# EAGLE board PFCEDU_V2 (EAGLE 9.1.1), part 1 of 3
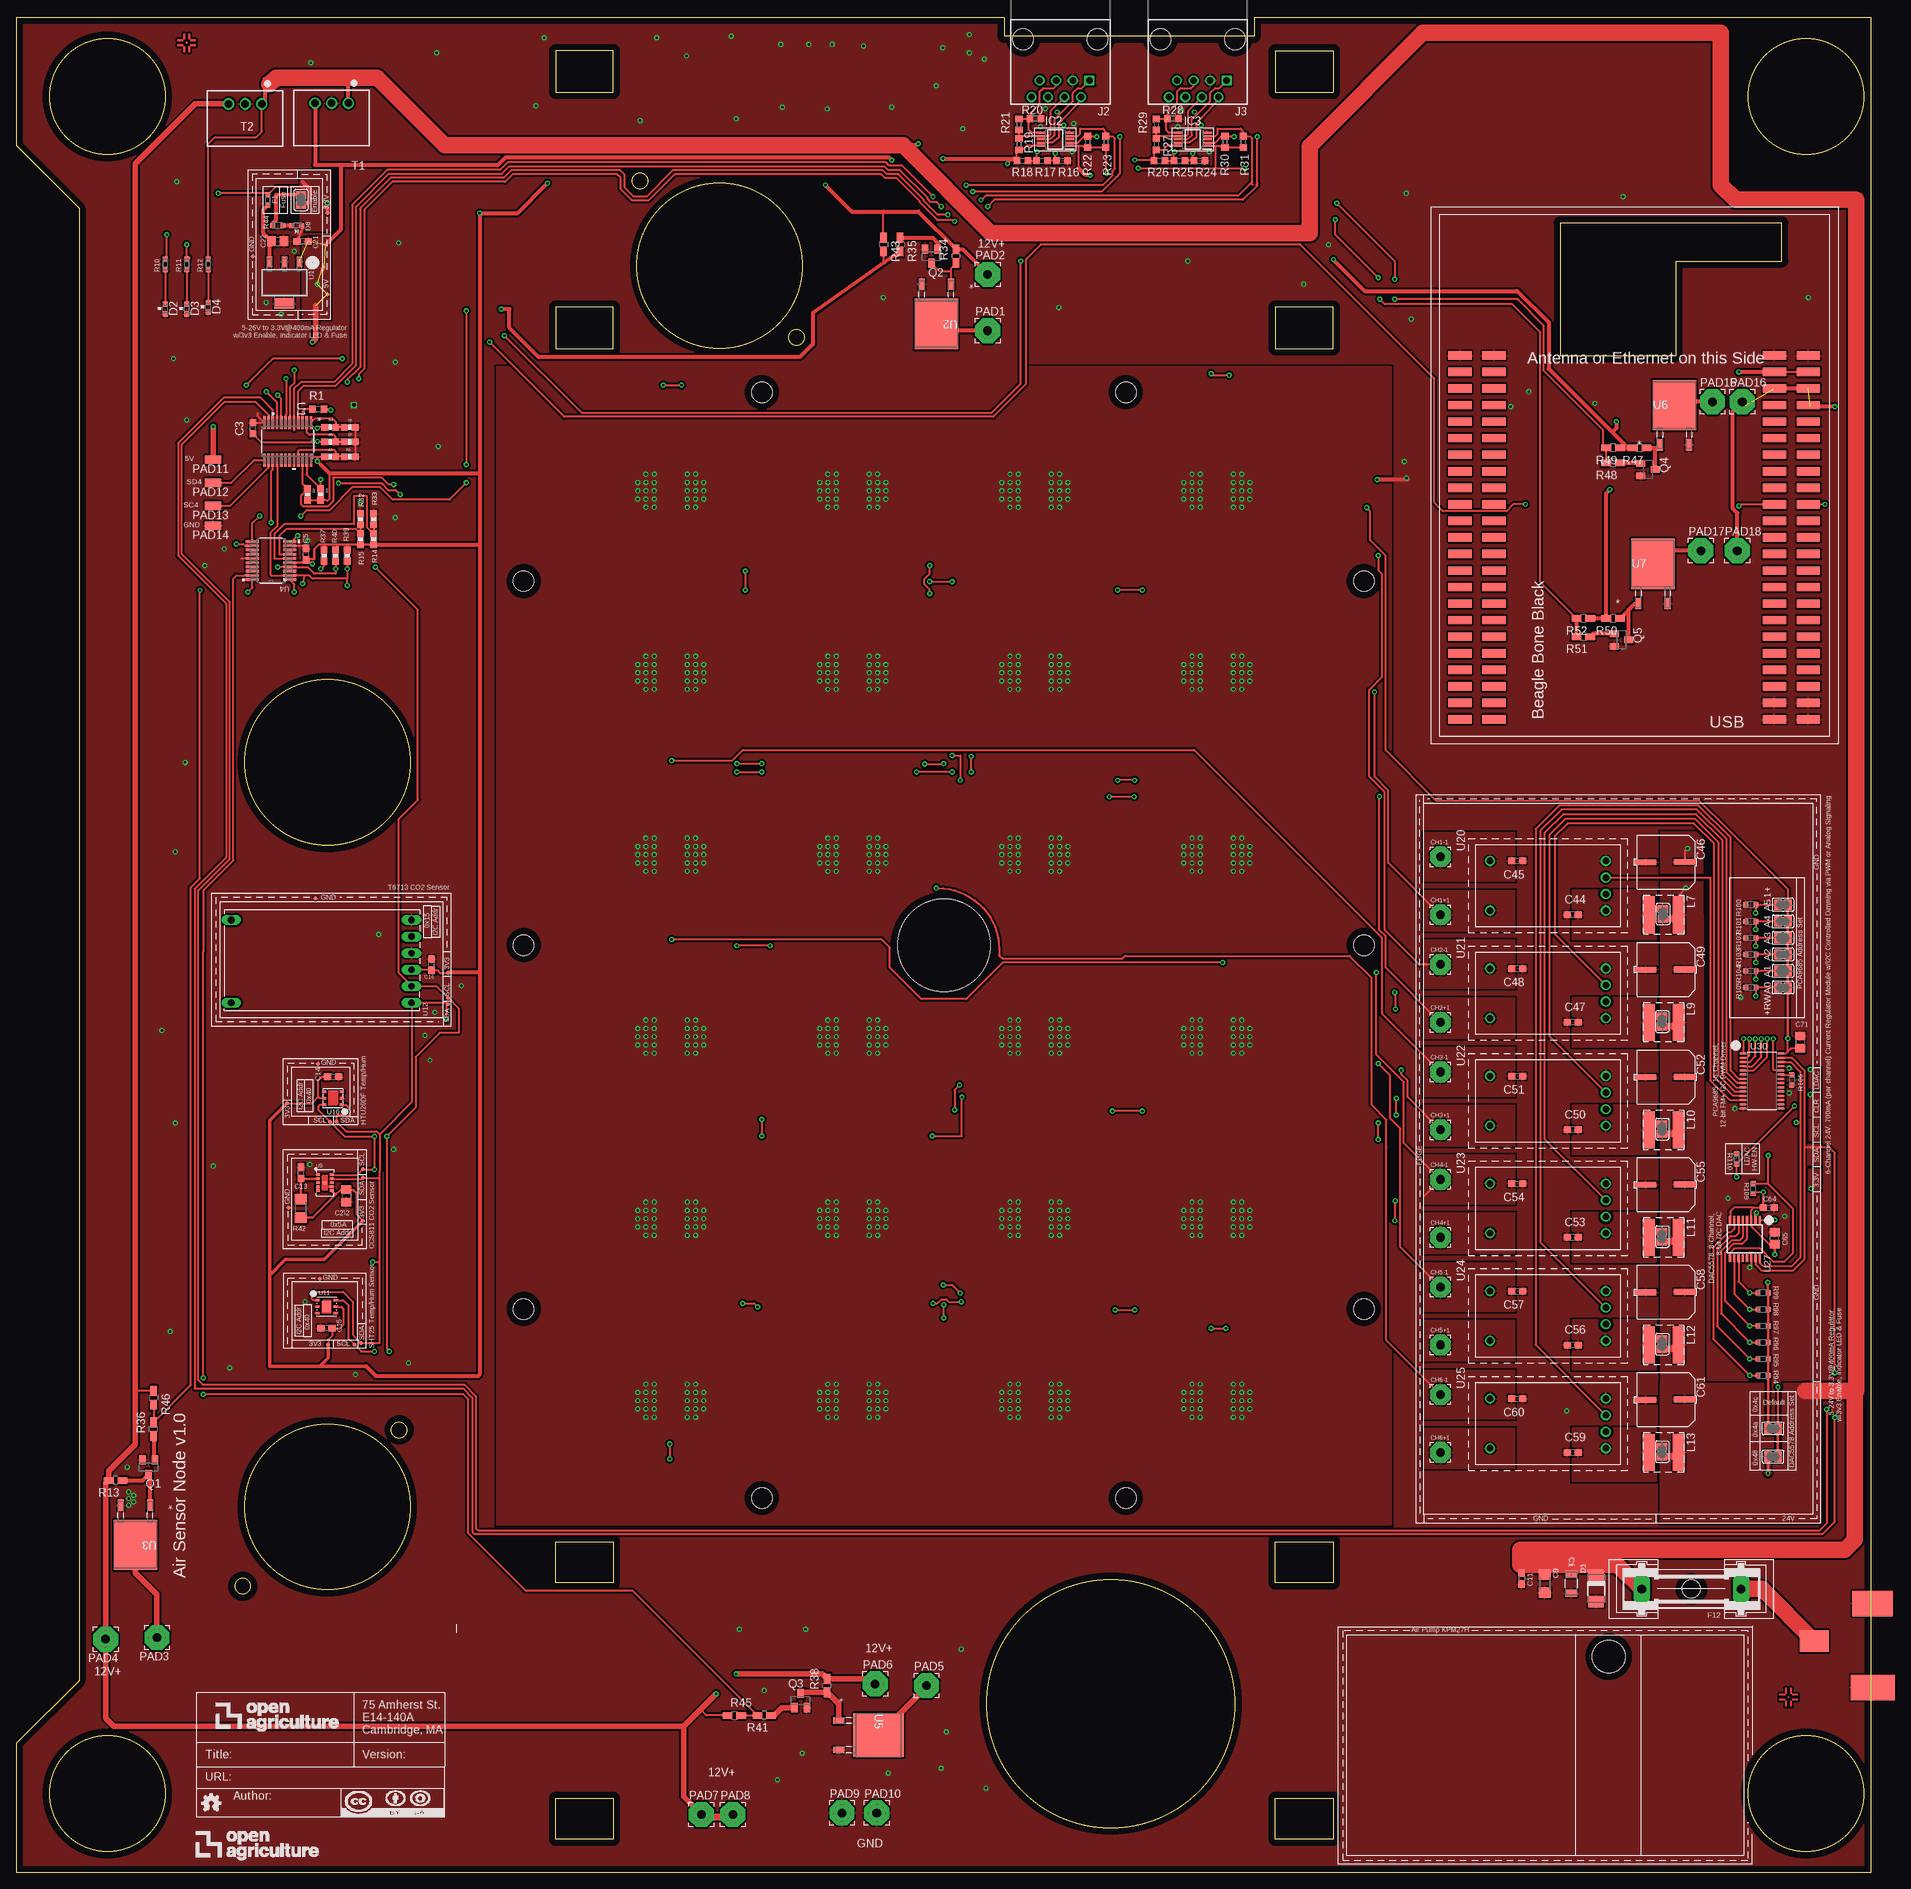
[diagram p3: board, top side]
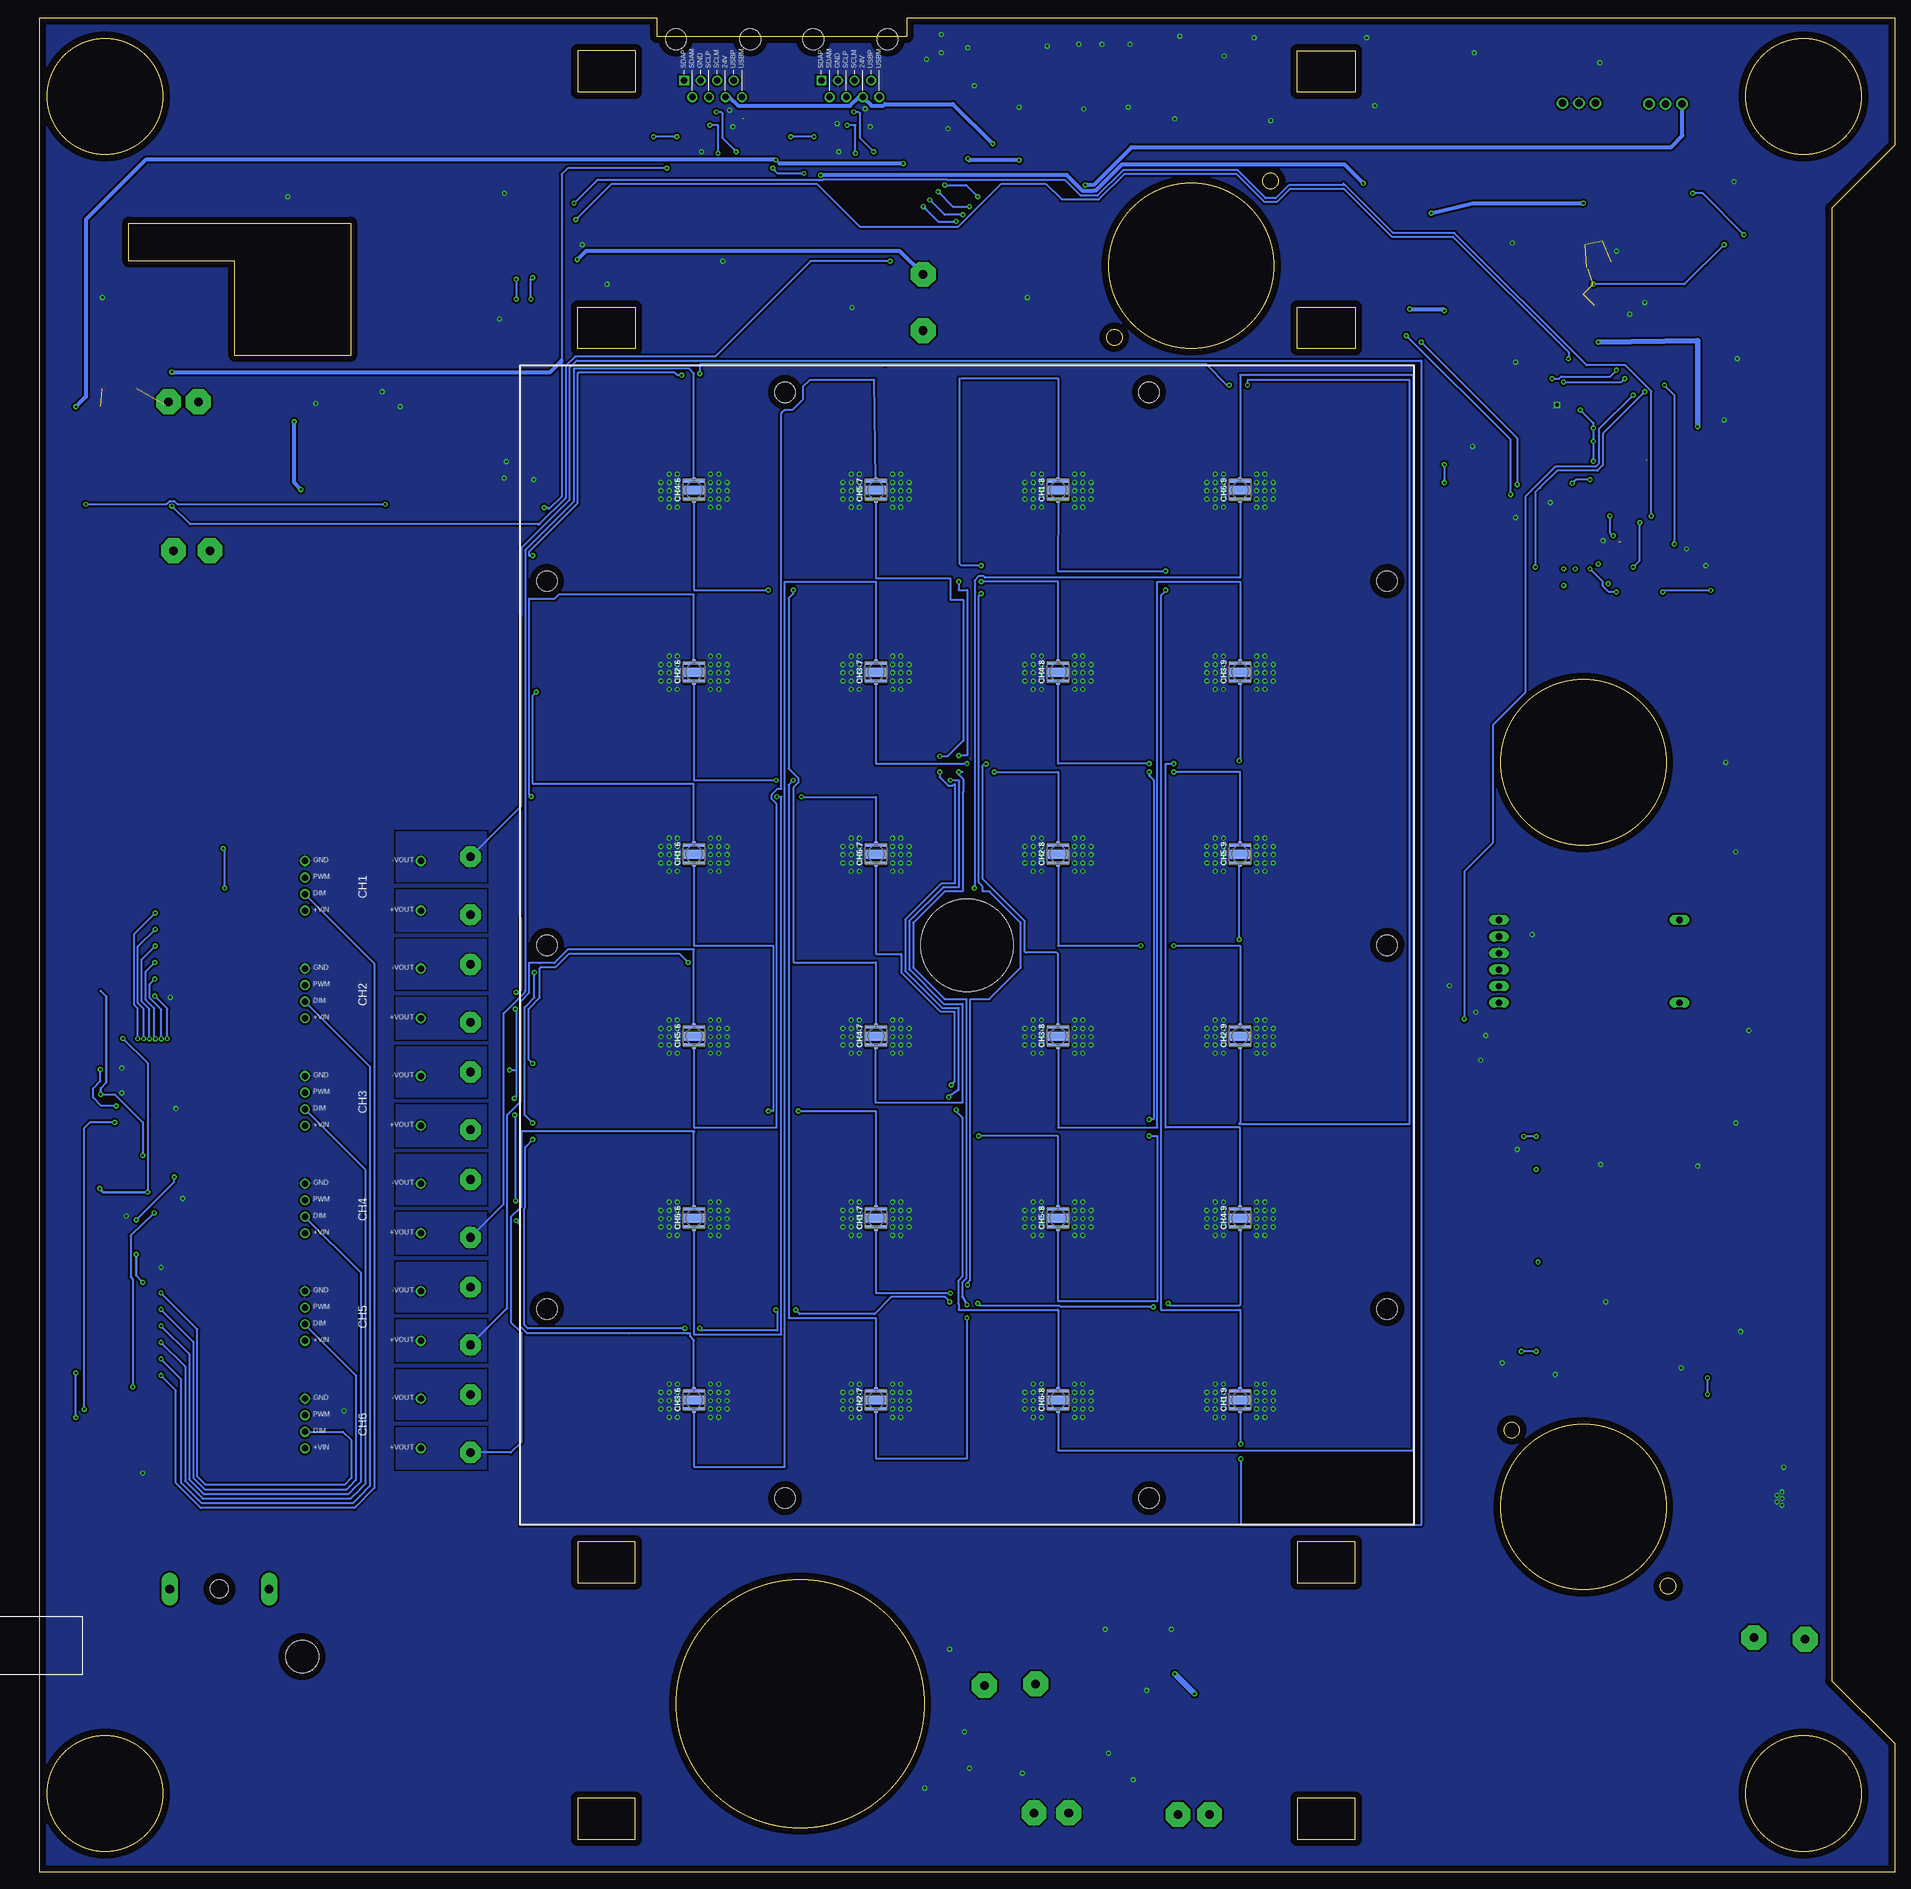
[diagram p4: board, bottom side, seen from below]

Size 284.73 x 284.79 mm. Coordinates in mm from the lower left corner, seen from the top.
Outline: 224.54,284.73 284.73,284.73 284.73,0 0,0 0,19.81 9.65,29.46 9.65,255.52 0,265.18 0,284.73 151.62,284.73 151.62,281.94 189.99,281.94 189.99,284.79 224.73,284.73
Outline: 91.66,279.71 82.77,279.71 82.77,273.36 91.66,273.36 91.66,279.71
Outline: 91.66,240.34 82.77,240.34 82.77,233.99 91.66,233.99 91.66,240.34
Outline: 202.15,240.34 193.26,240.34 193.26,233.99 202.15,233.99 202.15,240.34
Outline: 193.26,273.36 202.15,273.36 202.15,279.71 193.26,279.71 193.26,273.36
Outline: 202.15,11.43 202.15,5.08 193.26,5.08 193.26,11.43 202.15,11.43
Outline: 202.15,50.8 202.15,44.45 193.26,44.45 193.26,50.8 202.15,50.8
Outline: 91.66,11.43 91.66,5.08 82.77,5.08 82.77,11.43 91.66,11.43
Outline: 91.66,50.8 91.66,44.45 82.77,44.45 82.77,50.8 91.66,50.8
Outline: 236.98,253.24 236.98,232.92 254.76,232.92 254.76,247.4 271.02,247.4 271.02,253.24 236.98,253.24
Outline: circle at 274.7,12.1 radius 8.89
Outline: circle at 13.97,12.1 radius 8.89
Outline: circle at 119.75,235.7 radius 1.2
Outline: circle at 95.76,259.68 radius 1.2
Outline: circle at 58.75,67.93 radius 1.2
Outline: circle at 34.76,43.94 radius 1.2
Outline: circle at 47.75,170.43 radius 12.7
Outline: circle at 47.75,56.13 radius 12.7
Outline: circle at 274.7,272.69 radius 8.89
Outline: circle at 167.99,25.91 radius 19.05
Outline: circle at 107.95,246.69 radius 12.7
Outline: circle at 13.97,272.69 radius 8.89
Copper layers (1*16): Top 0.035mm / dielectric 1.5mm / Bottom 0.035mm
Design rules "default *": minimum track width 6mil, minimum drill 0.35mm, track to track 4mil, track to pad 4mil, pad to pad 6mil, via to via 6mil, smd to smd 6mil, copper to edge 40mil, drill to drill 6mil, minimum pad ring 10mil, minimum via ring 8mil, stop-mask expansion 4mil, vias tented up to drill 25mil, thermal gap 10mil
Net classes: 0 default: width 0.305 mm, drill 0.254 mm, clearance 0.254 mm
Holes 3.17 mm at 114.43,57.48 170.31,57.48 206.86,86.51 206.86,142.39 206.86,198.27 170.31,227.28 114.43,227.28 77.88,198.27 77.88,142.39 77.88,86.51
Holes 14.22 mm at 142.37,142.37
Holes 5.08 mm at 244.42,33.15
Milling: 2 lines

## Footprints (pad centres in the part's own frame; a part is rotated, then mirrored left to right if it is on the bottom)
CAP_C1206 = smd 1.118 x 1.803: 1 -1.499,0; 2 1.499,0
C0805 = smd 1.3 x 1.5: 1 -0.95,0; 2 0.95,0
C0603@1 = smd 1.1 x 1: 1 -0.85,0; 2 0.85,0
C1206 = smd 1.6 x 1.8: 1 -1.4,0; 2 1.4,0
C0603 = smd 1.1 x 1: 1 -0.85,0; 2 0.85,0
EEE-1HA101UP = smd 0.889 x 3.404: + 0,-3.251 | smd 0.889 x 3.251: - -0.051,2.794
3,17/1,3 = drill 1.321 pad 3.175 octagon: 1 0,0
CREE-XLAMP-XP-E = smd 0.5 x 3.3: A 1.4,0; C -1.4,0 | smd 0.45 x 0.5: A@1 1.725,0; C@1 -1.725,0 | smd 1.3 x 3.3: THERM 0,0
DO-214AC = smd 1.8 x 2.4: A 2.025,0; C -2.025,0
CHIPLED_0603 = smd 0.8 x 0.8: A 0,-0.75; C 0,0.75
0603 = smd 0.756 x 0.8: 1 -0.778,0; 2 0.778,0
GSH15 = drill 1.321 pad 2.54 long: 1 -7.62,0; 2 7.62,0 | hole 2.794: 0,0
SOP50P490X110-10N = smd 1.4 x 0.3: 1 -2.2,1; 2 -2.2,0.5; 3 -2.2,0; 4 -2.2,-0.5; 5 -2.2,-1; 6 2.2,-1; 7 2.2,-0.5; 8 2.2,0; 9 2.2,0.5; 10 2.2,1
OPENAG-V1-RJ45 = drill 1: 24V(6) 1.905,8.89; DSCLM(5) 0.635,6.35; DSCLP(4) -0.635,8.89; DSDAM(2) -3.175,8.89; GND(3) -1.905,6.35; USBM(8) 4.445,8.89; USBP(7) 3.175,6.35 | drill 1 square: DSDAP(1) -4.445,6.35 | hole 3.2: -5.715,0; 5.715,0
74404064121 = smd 1.8 x 5.7: 1 -2.3,0; 2 2.3,0
3,81/1,3 = drill 1.321 pad 3.81 octagon: 1 0,0
SMD1,27-2,54 = smd 1.27 x 2.54: 1 0,0
SOT23-BEC = smd 1 x 1.4: B -0.95,-1.1; C 0,1.1; E 0.95,-1.1
R0603 = smd 1 x 1.1: 1 -0.85,0; 2 0.85,0
0603-RES = smd 1.1 x 1: 1 -0.85,0; 2 0.85,0
RC0603N = smd 0.756 x 0.8: 1 -0.778,0; 2 0.778,0
R0805W = smd 1.5 x 1: 1 -1.052,0; 2 1.052,0
R1206 = smd 1.6 x 1.803: 1 -1.422,0; 2 1.422,0
SOLDERJUMPER_REFLOW_NOPASTE = smd 1.168 x 1.6: 1 -0.762,0; 2 0.762,0
R-78E5.0-1.0 = drill 1.15 pad 1.75: 1 3.21,2; 2 5.75,2; 3 8.29,2
TP06R = smd 0.6 x 0.6: TP 0,0
PW24-M = smd 1.981 x 0.406: 1 -2.87,3.575; 2 -2.87,2.925; 3 -2.87,2.275; 4 -2.87,1.625; 5 -2.87,0.975; 6 -2.87,0.325; 7 -2.87,-0.325; 8 -2.87,-0.975; 9 -2.87,-1.625; 10 -2.87,-2.275; 11 -2.87,-2.925; 12 -2.87,-3.575; 13 2.87,-3.575; 14 2.87,-2.925; 15 2.87,-2.275; 16 2.87,-1.625; 17 2.87,-0.975; 18 2.87,-0.325; 19 2.87,0.325; 20 2.87,0.975; 21 2.87,1.625; 22 2.87,2.275; 23 2.87,2.925; 24 2.87,3.575
DPAK = smd 0.94 x 1.702: 1 -2.25,-6.109; 2 2.25,-6.109 | smd 6.655 x 7.722: 3 0,0
PW20-M = smd 1.981 x 0.406: 1 -2.87,2.925; 2 -2.87,2.275; 3 -2.87,1.625; 4 -2.87,0.975; 5 -2.87,0.325; 6 -2.87,-0.325; 7 -2.87,-0.975; 8 -2.87,-1.625; 9 -2.87,-2.275; 10 -2.87,-2.925; 11 2.87,-2.925; 12 2.87,-2.275; 13 2.87,-1.625; 14 2.87,-0.975; 15 2.87,-0.325; 16 2.87,0.325; 17 2.87,0.975; 18 2.87,1.625; 19 2.87,2.275; 20 2.87,2.925
CCS811 = smd 0.6 x 0.4: 1 -1.05,1.2; 2 -1.05,0.6; 3 -1.05,0; 4 -1.05,-0.6; 5 -1.05,-1.2; 6 1.05,-1.2; 7 1.05,-0.6; 8 1.05,0; 9 1.05,0.6; 10 1.05,1.2; EP 0,0
HTU20D(F) = smd 0.4 x 0.6: 1 -1,-1.35; 2 0,-1.35; 3 1,-1.35; 4 1,1.35; 5 0,1.35; 6 -1,1.35
SHT2X = smd 0.3 x 0.4: 1 -1,-1.4; 2 0,-1.4; 3 1,-1.4; 4 1,1.4; 5 0,1.4; 6 -1,1.4 | smd 1.651 x 1.27: 7 0,0
T6713 = drill 1.016 long: 1 1.27,-1.27; 2 1.27,-3.81; 3 1.27,-6.35; 4 1.27,-8.89; 5 1.27,-11.43; 6 1.27,-13.97; 7 28.96,-13.97; 8 28.96,-1.27
MP04A = smd 1.6 x 0.838: 1 -3.2,2.3; 2 -3.2,0; 3 -3.2,-2.3 | smd 1.6 x 3.099: 4 3.2,0
RCD-24-PINNED = drill 1: 1 0,0; 2 0,-2.54; 3 0,-5.08; 4 0,-7.62; 5 17.78,-7.62; 6 17.78,0
TSSOP16 = smd 0.35 x 1.2: 1 -2.275,-2.925; 2 -1.625,-2.925; 3 -0.975,-2.925; 4 -0.325,-2.925; 5 0.325,-2.925; 6 0.975,-2.925; 7 1.625,-2.925; 8 2.275,-2.925; 9 2.275,2.925; 10 1.625,2.925; 11 0.975,2.925; 12 0.325,2.925; 13 -0.325,2.925; 14 -0.975,2.925; 15 -1.625,2.925; 16 -2.275,2.925
TSSOP28 = smd 0.305 x 0.991: 1 -4.225,-2.918; 2 -3.575,-2.918; 3 -2.925,-2.918; 4 -2.275,-2.918; 5 -1.625,-2.918; 6 -0.975,-2.918; 7 -0.325,-2.918; 8 0.325,-2.918; 9 0.975,-2.918; 10 1.625,-2.918; 11 2.275,-2.918; 12 2.925,-2.918; 13 3.575,-2.918; 14 4.225,-2.918; 15 4.225,2.918; 16 3.575,2.918; 17 2.925,2.918; 18 2.275,2.918; 19 1.625,2.918; 20 0.975,2.918; 21 0.325,2.918; 22 -0.325,2.918; 23 -0.975,2.918; 24 -1.625,2.918; 25 -2.275,2.918; 26 -2.925,2.918; 27 -3.575,2.918; 28 -4.225,2.918
PJ-036AH = smd 4.4 x 3.3: 1 2.2,-0.65 | smd 6.75 x 3.9: 2 -6.75,6.45 | smd 6.2 x 3.9: 3 -6.75,-6.45
23PINHEADERSMD = smd 1.27 x 3.556: AIN0 7.62,0; AIN1 7.62,5.207; AIN2 10.16,0; AIN3 10.16,5.207; AIN4 15.24,0; AIN5 12.7,5.207; AIN6 12.7,0; DGND 55.88,0; DGND1 2.54,0; DGND2 0,0; DGND3 0,5.207; DGND4 2.54,5.207; DGND5 55.88,5.207; DGND6 55.88,48.26; DGND7 55.88,53.467; ECAPWMO 5.08,5.207; EHRPWM1A 40.64,5.207; EHRPWM1B 38.1,5.207; EHRPWM2A 33.02,48.26; EHRPWM2B 40.64,48.26; GND_ADC 15.24,5.207; GPIO_20 5.08,0; GPIO_26 40.64,53.467; GPIO_27 35.56,48.26; GPIO_44 43.18,53.467; GPIO_45 43.18,48.26; GPIO_46 38.1,53.467; GPIO_47 38.1,48.26; GPIO_48 38.1,0; GPIO_49 27.94,0; GPIO_60 43.18,5.207; GPIO_61 25.4,53.467; GPIO_65 35.56,53.467; GPIO_66 48.26,48.26; GPIO_67 48.26,53.467; GPIO_68 45.72,53.467; GPIO_69 45.72,48.26; GPIO_112 20.32,5.207; GPIO_115 22.86,0; GPIO_117 25.4,0; I2C2_SCL 33.02,0; I2C_SDA 33.02,5.207; LCD_AC_BIAS 20.32,53.467; LCD_DATA0 0,48.26; LCD_DATA1 0,53.467; LCD_DATA2 2.54,48.26; LCD_DATA3 2.54,53.467; LCD_DATA4 5.08,48.26; LCD_DATA5 5.08,53.467; LCD_DATA6 7.62,48.26; LCD_DATA7 7.62,53.467; LCD_DATA8 10.16,48.26; LCD_DATA9 10.16,53.467; LCD_DATA10 12.7,53.467; LCD_DATA11 15.24,53.467; LCD_DATA12 12.7,48.26; LCD_DATA13 15.24,48.26; LCD_DATA14 17.78,48.26; LCD_DATA15 17.78,53.467; LCD_HSYNC 20.32,48.26; LCD_PCLK 22.86,53.467; LCD_VSYNC 22.86,48.26; MMC1_CLK 30.48,48.26; MMC1_CMD 33.02,53.467; MMC1_DAT0 25.4,48.26; MMC1_DAT1 27.94,53.467; MMC1_DAT2 50.8,48.26; MMC1_DAT3 50.8,53.467; MMC1_DAT4 27.94,48.26; MMC1_DAT5 30.48,53.467; MMC1_DAT6 53.34,48.26; MMC1_DAT7 53.34,53.467; PWR_BUT 45.72,0; SP11_CS0 22.86,5.207; SP11_DO 20.32,0; SP11_SCLK 17.78,0; SPIO_CS0 35.56,0; SPIO_D1 35.56,5.207; SPIO_DO 30.48,0; SPIO_SLCK 30.48,5.207; SYS5V 48.26,0; SYS5V1 48.26,5.207; SYS_RESET 45.72,5.207; UART1_RXD 25.4,5.207; UART1_TXD 27.94,5.207; UART4_RXD 43.18,0; UART4_TXD 40.64,0; VDD3.3 53.34,5.207; VDD3.31 53.34,0; VDD5V 50.8,0; VDD5V1 50.8,5.207; VDD_ADC 17.78,5.207

## Placement (x,y rotation side)
ATTRIBUTES  [DOCFIELD]  27.7,8.53 0 top
C1  4.7uF  [CAP_C1206]  238.69,44.36 270 top
C2\2  4.7uF  [C0805]  50.66,103.88 270 top
C3  .1uF  [C0603@1]  36.31,221.75 90 top
C5  .1uF  [C0603@1]  44.45,202.44 90 top
C9  10uF  [C1206]  234.63,44.36 270 top
C11  .1uF  [C0603@1]  231.07,45.13 270 top
C13  0.1uF  [C0603]  43.68,107.43 90 top
C14  0.1uF  [C0603]  48.63,122.17 0 top
C15  0.1uF  [C0603]  47.61,83.56 180 top
C16  0.1uF  [C0603]  63.74,139.39 90 top
C21  0.1uF  [C0603]  43.94,250.44 180 top
C22  10uF  [C0805]  40.13,250.44 0 top
C44  10nF  [C0603]  238.91,147.04 180 top
C45  10nF  [C0603]  230.4,155.3 0 top
C46  100uF  [EEE-1HA101UP]  252.88,155.17 90 top
C47  10nF  [C0603]  238.91,130.53 180 top
C48  10nF  [C0603]  230.4,138.79 0 top
C49  100uF  [EEE-1HA101UP]  252.88,138.66 90 top
C50  10nF  [C0603]  238.91,114.02 180 top
C51  10nF  [C0603]  230.4,122.28 0 top
C52  100uF  [EEE-1HA101UP]  252.88,122.15 90 top
C53  10nF  [C0603]  238.91,97.51 180 top
C54  10nF  [C0603]  230.4,105.77 0 top
C55  100uF  [EEE-1HA101UP]  252.88,105.64 90 top
C56  10nF  [C0603]  238.91,81 180 top
C57  10nF  [C0603]  230.4,89.26 0 top
C58  100uF  [EEE-1HA101UP]  252.88,89.13 90 top
C59  10nF  [C0603]  238.91,64.49 180 top
C60  10nF  [C0603]  230.4,72.75 0 top
C61  100uF  [EEE-1HA101UP]  252.88,72.62 90 top
C64  0.1uF  [C0603]  269.01,102.08 0 top
C65  4.7uF  [C0805]  269.9,97.38 90 top
C71  10uF  [C0805]  273.84,127.48 90 top
CH1+1  [3,17/1,3]  218.59,147.04 0 top
CH1-1  [3,17/1,3]  218.59,155.93 0 top
CH1-6  XP-E  [CREE-XLAMP-XP-E]  184.28,156.36 90 bottom
CH1-7  XP-E  [CREE-XLAMP-XP-E]  156.34,100.48 90 bottom
CH1-8  XP-E  [CREE-XLAMP-XP-E]  128.4,212.24 90 bottom
CH1-9  XP-E  [CREE-XLAMP-XP-E]  100.46,72.54 90 bottom
CH2+1  [3,17/1,3]  218.59,130.53 0 top
CH2-1  [3,17/1,3]  218.59,139.42 0 top
CH2-6  XP-E  [CREE-XLAMP-XP-E]  184.28,184.3 90 bottom
CH2-7  XP-E  [CREE-XLAMP-XP-E]  156.34,72.54 90 bottom
CH2-8  XP-E  [CREE-XLAMP-XP-E]  128.4,156.36 90 bottom
CH2-9  XP-E  [CREE-XLAMP-XP-E]  100.46,128.42 90 bottom
CH3+1  [3,17/1,3]  218.59,114.02 0 top
CH3-1  [3,17/1,3]  218.59,122.91 0 top
CH3-6  XP-E  [CREE-XLAMP-XP-E]  184.28,72.54 90 bottom
CH3-7  XP-E  [CREE-XLAMP-XP-E]  156.34,184.3 90 bottom
CH3-8  XP-E  [CREE-XLAMP-XP-E]  128.4,128.42 90 bottom
CH3-9  XP-E  [CREE-XLAMP-XP-E]  100.46,184.3 90 bottom
CH4+1  [3,17/1,3]  218.59,97.51 0 top
CH4-1  [3,17/1,3]  218.59,106.4 0 top
CH4-6  XP-E  [CREE-XLAMP-XP-E]  184.28,212.24 90 bottom
CH4-7  XP-E  [CREE-XLAMP-XP-E]  156.34,128.42 90 bottom
CH4-8  XP-E  [CREE-XLAMP-XP-E]  128.4,184.3 90 bottom
CH4-9  XP-E  [CREE-XLAMP-XP-E]  100.46,100.48 90 bottom
CH5+1  [3,17/1,3]  218.59,81 0 top
CH5-1  [3,17/1,3]  218.59,89.89 0 top
CH5-6  XP-E  [CREE-XLAMP-XP-E]  184.28,128.42 90 bottom
CH5-7  XP-E  [CREE-XLAMP-XP-E]  156.34,212.24 90 bottom
CH5-8  XP-E  [CREE-XLAMP-XP-E]  128.4,100.48 90 bottom
CH5-9  XP-E  [CREE-XLAMP-XP-E]  100.46,156.36 90 bottom
CH6+1  [3,17/1,3]  218.59,64.49 0 top
CH6-1  [3,17/1,3]  218.59,73.38 0 top
CH6-6  XP-E  [CREE-XLAMP-XP-E]  184.28,100.48 90 bottom
CH6-7  XP-E  [CREE-XLAMP-XP-E]  156.34,156.36 90 bottom
CH6-8  XP-E  [CREE-XLAMP-XP-E]  128.4,72.54 90 bottom
CH6-9  XP-E  [CREE-XLAMP-XP-E]  100.46,212.24 90 bottom
D1  SMAJ14A  [DO-214AC]  242.5,43.6 270 top
D2  APT1608CGCK  [CHIPLED_0603]  22.87,240.04 180 top
D3  APT1608CGCK  [CHIPLED_0603]  26.17,240.04 180 top
D4  APT1608CGCK  [CHIPLED_0603]  29.47,240.29 180 top
D8  APT1608CGCK  [CHIPLED_0603]  43.05,252.86 270 top
F1  0448.400MR  [0603]  38.61,256.79 90 top
F12  [GSH15]  257.12,43.52 180 top
IC2  PCA9615DP  [SOP50P490X110-10N]  159.5,266.11 180 top
IC3  PCA9615DP  [SOP50P490X110-10N]  180.58,266.11 180 top
J2  54602-908LF  [OPENAG-V1-RJ45]  160.26,281.48 180 top
J3  54602-908LF  [OPENAG-V1-RJ45]  181.35,281.48 180 top
L7  120uH  [74404064121]  252.88,147.04 180 top
L9  120uH  [74404064121]  252.88,130.53 180 top
L10  120uH  [74404064121]  252.88,114.02 180 top
L11  120uH  [74404064121]  252.88,97.51 180 top
L12  120uH  [74404064121]  252.88,81 180 top
L13  120uH  [74404064121]  252.88,64.49 180 top
PAD1  WIREPAD3,81/1,3  [3,81/1,3]  149.1,236.73 0 top
PAD2  WIREPAD3,81/1,3  [3,81/1,3]  149.1,245.36 0 top
PAD3  WIREPAD3,81/1,3  [3,81/1,3]  21.59,36.07 180 top
PAD4  WIREPAD3,81/1,3  [3,81/1,3]  13.72,35.81 180 top
PAD5  WIREPAD3,81/1,3  [3,81/1,3]  139.7,28.7 0 top
PAD6  WIREPAD3,81/1,3  [3,81/1,3]  131.83,28.96 0 top
PAD7  WIREPAD3,81/1,3  [3,81/1,3]  105.16,8.89 0 top
PAD8  WIREPAD3,81/1,3  [3,81/1,3]  109.98,8.89 0 top
PAD9  WIREPAD3,81/1,3  [3,81/1,3]  126.75,9.14 0 top
PAD10  WIREPAD3,81/1,3  [3,81/1,3]  132.08,9.14 0 top
PAD11  [SMD1,27-2,54]  30.23,216.92 90 top
PAD12  [SMD1,27-2,54]  30.23,213.36 90 top
PAD13  [SMD1,27-2,54]  30.23,209.8 90 top
PAD14  [SMD1,27-2,54]  30.23,206.76 90 top
PAD15  WIREPAD3,81/1,3  [3,81/1,3]  260.35,225.81 0 top
PAD16  WIREPAD3,81/1,3  [3,81/1,3]  264.92,225.81 0 top
PAD17  WIREPAD3,81/1,3  [3,81/1,3]  258.57,202.95 0 top
PAD18  WIREPAD3,81/1,3  [3,81/1,3]  264.16,202.95 0 top
Q1  MMBT2222A  [SOT23-BEC]  20.32,62.23 180 top
Q2  MMBT2222A  [SOT23-BEC]  140.46,248.16 180 top
Q3  MMBT2222A  [SOT23-BEC]  120.4,26.42 0 top
Q4  MMBT2222A  [SOT23-BEC]  250.44,215.39 270 top
Q5  MMBT2222A  [SOT23-BEC]  246.38,189.23 270 top
R1  10K  [R0603]  46.35,224.67 0 top
R2  10K  [0603-RES]  48.18,217.36 180 top
R3  10K  [0603-RES]  51.17,217.36 180 top
R4  10K  [0603-RES]  48.2,221.9 180 top
R5  10K  [0603-RES]  51.17,221.9 180 top
R6  10K  [0603-RES]  48.18,219.64 180 top
R7  10K  [0603-RES]  51.17,219.64 180 top
R8  10K  [0603-RES]  44.71,211.59 270 top
R9  10K  [0603-RES]  46.73,211.59 270 top
R10  100  [RC0603N]  22.87,246.9 90 top
R11  100  [RC0603N]  26.17,246.9 90 top
R12  100  [RC0603N]  29.47,246.9 90 top
R13  [R0805W]  15.24,60.2 180 top
R14  10K  [0603-RES]  54.86,204.72 270 top
R15  10K  [0603-RES]  52.83,204.72 270 top
R16  600  [R0603]  160.52,262.81 0 top
R17  120  [R0603]  157.47,262.81 0 top
R18  600  [R0603]  154.42,262.81 0 top
R19  600  [R0603]  153.91,265.35 270 top
R20  600  [R0603]  156.45,269.28 180 top
R21  120  [R0603]  153.91,268.39 270 top
R22  10K  [R0603]  164.45,265.73 270 top
R23  10K  [R0603]  167.25,265.73 270 top
R24  600  [R0603]  181.6,262.81 0 top
R25  120  [R0603]  178.55,262.81 0 top
R26  600  [R0603]  175.5,262.81 0 top
R27  600  [R0603]  175,265.35 270 top
R28  600  [R0603]  177.54,269.28 180 top
R29  120  [R0603]  175,268.39 270 top
R30  10K  [R0603]  185.54,265.73 270 top
R31  10K  [R0603]  188.33,265.73 270 top
R32  10K  [0603-RES]  52.83,207.77 270 top
R33  10K  [0603-RES]  54.86,207.77 270 top
R34  [R0805W]  144.27,248.16 90 top
R35  [R0805W]  135.64,249.94 270 top
R36  [R0805W]  21.08,68.07 90 top
R37  10K  [0603-RES]  47.24,202.18 90 top
R38  [R0805W]  124.46,28.7 90 top
R39  10K  [0603-RES]  50.8,202.18 90 top
R40  10K  [0603-RES]  49.02,202.18 90 top
R41  [R0805W]  114.81,24.13 180 top
R42  4.7K  [R1206]  43.68,101.97 270 top
R43  [R0805W]  133.1,249.94 270 top
R44  100  [RC0603N]  40.13,252.86 180 top
R45  [R0805W]  110.24,24.13 0 top
R46  [R0805W]  21.08,72.9 270 top
R47  [R0805W]  249.17,218.69 180 top
R48  [R0805W]  245.11,216.41 180 top
R49  [R0805W]  245.11,218.69 180 top
R50  [R0805W]  245.11,192.53 180 top
R51  [R0805W]  240.54,189.74 180 top
R52  [R0805W]  240.54,192.53 180 top
R94  1K  [RC0603N]  268.12,76.3 180 top
R95  1K  [RC0603N]  268.12,78.84 180 top
R96  1K  [RC0603N]  268.12,81.38 180 top
R97  1K  [RC0603N]  268.12,83.92 180 top
R98  1K  [RC0603N]  268.12,86.46 180 top
R99  1K  [RC0603N]  268.12,89 180 top
R100  10K  [RC0603N]  266.23,148.56 0 top
R101  10K  [RC0603N]  266.23,146.02 0 top
R102  10K  [RC0603N]  266.23,143.48 0 top
R103  10K  [RC0603N]  266.26,140.94 0 top
R104  10K  [RC0603N]  266.26,138.4 0 top
R105  10K  [RC0603N]  266.26,135.86 0 top
R106  10K  [RC0603N]  272.54,121.7 270 top
R109  1K  [RC0603N]  266.6,105 90 top
R110  0 OHM  [RC0603N]  264.06,109.58 270 top
SJ1  [SOLDERJUMPER_REFLOW_NOPASTE]  43.69,256.79 270 top
SJ_A18  [SOLDERJUMPER_REFLOW_NOPASTE]  271.16,135.86 180 top
SJ_A19  [SOLDERJUMPER_REFLOW_NOPASTE]  271.16,138.4 180 top
SJ_A20  [SOLDERJUMPER_REFLOW_NOPASTE]  271.16,140.94 180 top
SJ_A21  [SOLDERJUMPER_REFLOW_NOPASTE]  271.16,143.48 180 top
SJ_A22  [SOLDERJUMPER_REFLOW_NOPASTE]  271.16,146.02 180 top
SJ_A23  [SOLDERJUMPER_REFLOW_NOPASTE]  271.16,148.56 180 top
SJ_A24  [SOLDERJUMPER_REFLOW_NOPASTE]  252.76,147.17 270 top
SJ_A25  [SOLDERJUMPER_REFLOW_NOPASTE]  252.63,130.66 270 top
SJ_A26  [SOLDERJUMPER_REFLOW_NOPASTE]  252.63,114.15 270 top
SJ_A27  [SOLDERJUMPER_REFLOW_NOPASTE]  252.63,97.64 270 top
SJ_A28  [SOLDERJUMPER_REFLOW_NOPASTE]  252.63,81.13 270 top
SJ_A29  [SOLDERJUMPER_REFLOW_NOPASTE]  252.63,64.62 270 top
SJ_A34  [SOLDERJUMPER_REFLOW_NOPASTE]  269.65,68.17 0 top
SJ_A35  [SOLDERJUMPER_REFLOW_NOPASTE]  269.65,63.86 0 top
T1  R-78E5.0-1.0  [R-78E5.0-1.0]  54.17,273.64 180 top
T2  R-78E12.0-1.0  [R-78E5.0-1.0]  40.89,273.56 180 top
TP1  TPTP06R  [TP06R]  53.2,107.94 180 top
TP2  TPTP06R  [TP06R]  53.2,106.67 180 top
TP3  TPTP06R  [TP06R]  41.77,102.1 180 top
TP5  TPTP06R  [TP06R]  53.2,100.07 180 top
TP6  TPTP06R  [TP06R]  49.14,115.31 90 top
TP7  TPTP06R  [TP06R]  48.12,115.31 90 top
TP36  TPTP06R  [TP06R]  41.52,118.1 90 top
TP37  TPTP06R  [TP06R]  46.34,124.2 90 top
TP38  TPTP06R  [TP06R]  52.95,81.27 90 top
TP39  TPTP06R  [TP06R]  51.93,81.02 90 top
TP40  TPTP06R  [TP06R]  46.6,91.18 90 top
TP41  TPTP06R  [TP06R]  47.87,81.02 90 top
TP42  TPTP06R  [TP06R]  66.28,133.29 180 top
TP43  TPTP06R  [TP06R]  66.28,134.31 180 top
TP44  TPTP06R  [TP06R]  66.28,138.12 180 top
TP45  TPTP06R  [TP06R]  45.96,149.55 180 top
TP61  TPTP06R  [TP06R]  36.32,248.16 270 top
TP62  TPTP06R  [TP06R]  47.75,242.32 270 top
TP63  TPTP06R  [TP06R]  47.75,254.76 270 top
U1  TCA9548APWRPW24-M  [PW24-M]  41.65,219.72 270 top
U2  STD12NF06LT4  [DPAK]  141.22,237.74 180 top
U3  STD12NF06LT4  [DPAK]  18.29,50.29 180 top
U4  PCF8574APWRPW20-M  [PW20-M]  39.12,201.42 180 top
U5  STD12NF06LT4  [DPAK]  132.33,21.08 270 top
U6  STD12NF06LT4  [DPAK]  254.51,225.3 0 top
U7  STD12NF06LT4  [DPAK]  251.21,200.91 0 top
U9  CCS811  [CCS811]  47.36,105.91 0 top
U10  HPP845E034R5  [HTU20D(F)]  48.63,118.86 90 top
U11  SHT25  [SHT2X]  47.61,86.86 270 top
U12  T6713-5K  [T6713]  61.96,132.27 180 top
U17  LM2937IMP3.3NOPB  [MP04A]  41.15,244.09 270 top
U20  RCD-24-0.70/VREF  [RCD-24-PINNED]  243.99,147.68 180 top
U21  RCD-24-0.70/VREF  [RCD-24-PINNED]  243.99,131.17 180 top
U22  RCD-24-0.70/VREF  [RCD-24-PINNED]  243.99,114.66 180 top
U23  RCD-24-0.70/VREF  [RCD-24-PINNED]  243.99,98.15 180 top
U24  RCD-24-0.70/VREF  [RCD-24-PINNED]  243.99,81.64 180 top
U25  RCD-24-0.70/VREF  [RCD-24-PINNED]  243.99,65.13 180 top
U27  DAC5578SPW  [TSSOP16]  265.33,97.26 180 top
U30  PCA9685  [TSSOP28]  267.97,121.51 270 top
U$1  [PASSER-CIRCLE]  26.16,280.92 0 top
U$2  [PASSER-CIRCLE]  272.03,26.92 0 top
U$3  PJ-036AH  [PJ-036AH]  278.17,34.86 180 top
U$4  BBB_SMD  [23PINHEADERSMD]  275.08,177.04 90 top
U$9  [OPENAG-LOGO-750-MIL]  27.55,2.32 0 top